# EAGLE design ssr (EAGLE 9.3.2)
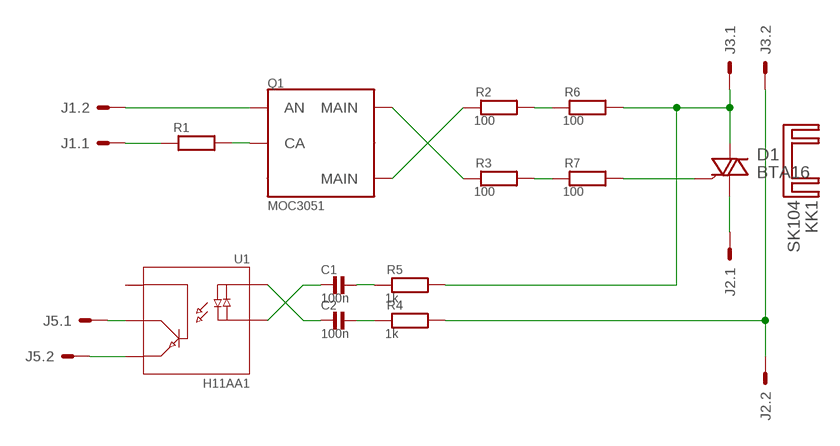
[diagram p0: schematic, sheet 1]

## Parts
C1  100n  MLCC_1206  [_1206]
C2  100n  MLCC_1206  [_1206]
D1  BTA16  [TO220DS]
J1  2EDG-2P  [2EDG-2P]
J2  2EDG-2P  [2EDG-2P]
J3  2EDG-2P  [2EDG-2P]
J5  2EDG-2P  [2EDG-2P]
KK1  SK104  [SK104]
Q1  MOC3051  [DIP-6-SMD]
R1  220  RESISTOR0603  [0603_WAVE]
R2  100  RESISTOR_1206  [_1206]
R3  100  RESISTOR_1206  [_1206]
R4  1k  RESISTOR_1206  [_1206]
R5  1k  RESISTOR_1206  [_1206]
R6  100  RESISTOR_1206  [_1206]
R7  100  RESISTOR_1206  [_1206]
U1  H11AA1  [DIP-6-SMD]

## Nets
GND: J1.P$1 R1.P$1
GND1: J5.P$2 U1.P$4(E)
N$2: Q1.P$2(CA) R1.P$2
N$3: J2.P$2 J3.P$2 R4.2
N$4: Q1.P$6(MAIN) R2.1
N$5: R3.2 R7.1
N$6: Q1.P$4(MAIN) R3.1
N$7: D1.A2 J3.P$1 R5.2 R6.2
N$8: D1.A1 J2.P$1
N$9: C1.1 R5.1
N$10: C1.2 U1.P$2(CA)
N$11: C2.2 U1.P$1(AC)
N$12: C2.1 R4.1
N$13: R2.2 R6.1
N$14: D1.G R7.2
N$15: J5.P$1 U1.P$5(C)
N$16: J1.P$2 Q1.P$1(AN)
Unconnected: U1.P$6(B)

## Library data of the parts
C1 C2 = Passive Components > Capacitors > Multilayer Ceramic Capacitors MLCC:MLCC: KEMET’s X7R dielectric features a 125°C maximum operating temperature and is considered temperature stable. The Electronics Components, Assemblies and Materials Association (EIA) characterizes X7R dielectric as a Class II material. Components of this classification are fixed, ceramic dielectric capacitors suited for bypass and decoupling applications or for frequency discriminating circuits where Q and stability of capacitance characteristics are not critical. X7R exhibits a predictable change in capacitance with respect to time and voltage, boasting a minimal change in capacitance with reference to ambient temperature. Capacitance change is limited to ±15% from −55°C to +125°C.
D1 = Semiconductors > Discrete Semiconductors > Thyristors > Triacs:BTA16
J1-J3 J5 = Connectors > Other:2EDG-2P
KK1 = Thermal Management > Heatsinks:SK104: HEATSINK manufacturer Fischer/distributor Buerklin
Q1 = Opto-electronics > Optocouplers\Photocouplers:MOC3051: The MOC3051-M and MOC3052-M consist of a AlGaAs infrared emitting diode optically coupled to a non-zero-crossing silicon bilateral AC switch (triac). These devices isolate low voltage logic from 115 and 240 Vac lines to provide random phase control of high current triacs or thyristors. These devices feature greatly enhanced static dv/dt capability to ensure stable switching performance of inductive loads.
R1-R7 = Passive Components > Resistors > Chip Resistors:RESISTOR: Resistors For new designs, use the packages preceded by an '_' character since they are more reliable: The following footprints should be used on most boards: _0402 - Standard footprint for regular board layouts _0603 - Standard footprint for regular board layouts _0805 - Standard footprint for regular board layouts _1206 - Standard footprint for regular board layouts For extremely tight-pitch boards where space is at a premium, the following 'micro-pitch' footprints can be used (smaller pads, no silkscreen outline, etc.): _0402MP - Micro-pitch footprint for very dense/compact boards _0603MP - Micro-pitch footprint for very dense/compact boards _0805MP - Micro-pitch footprint for very dense/compact boards _1206MP - Micro-pitch footprint for very dense/compact boards
U1 = Opto-electronics > Optocouplers\Photocouplers:H11AA1

## Board
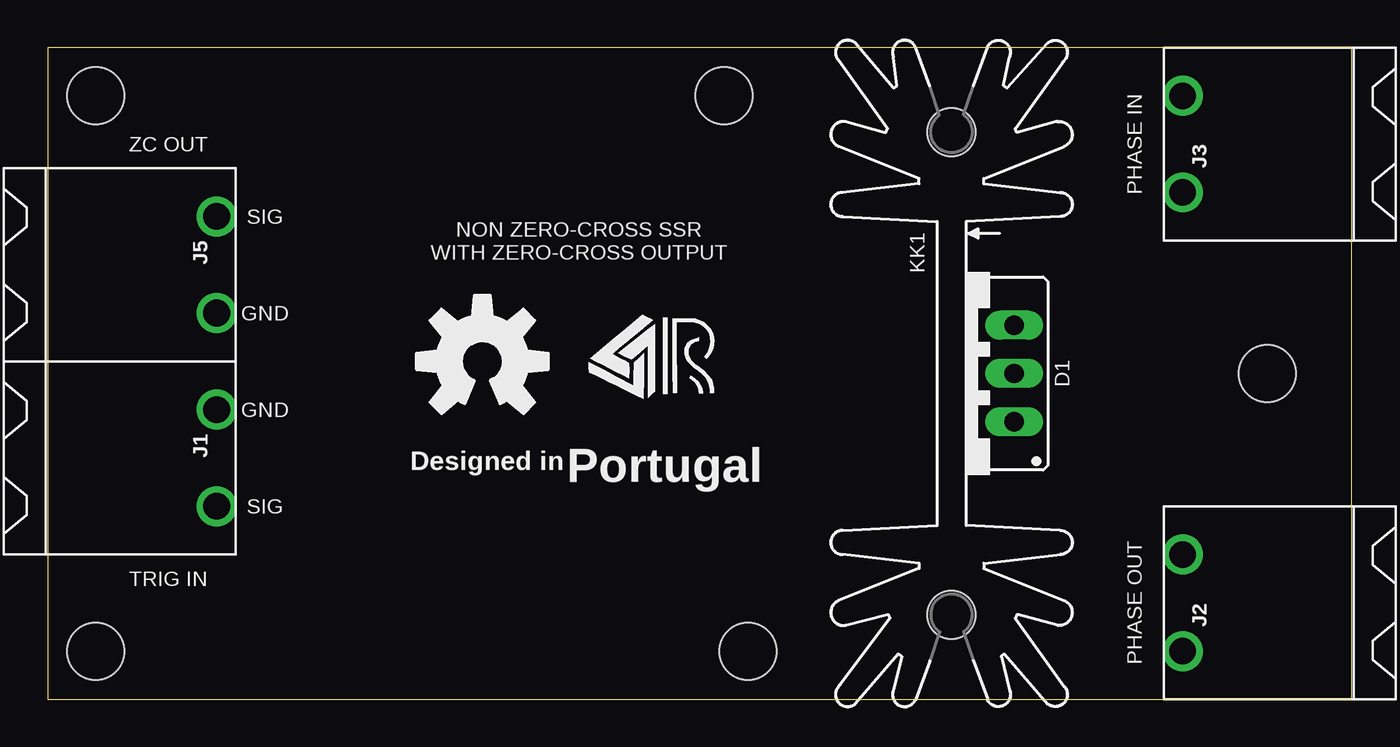
[diagram p1: board, top side]
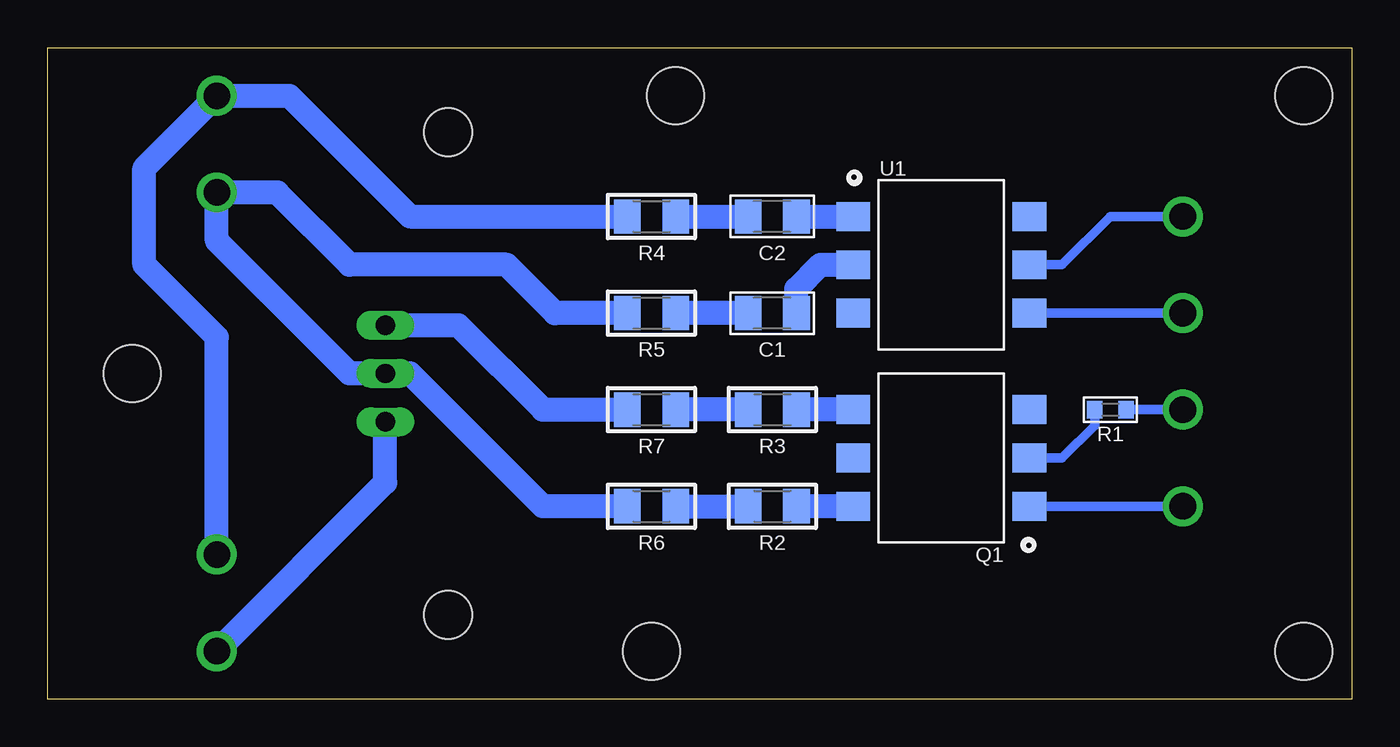
[diagram p2: board, bottom side, seen from below]

Size 68.59 x 34.29 mm. Coordinates in mm from the lower left corner, seen from the top.
Outline: 0.01,0 68.59,0 68.59,34.29 0,34.29 0.01,0
Copper layers (1*16): Top 0.035mm / dielectric 0.15mm / Bottom 0.035mm
Design rules "default": minimum track width 6mil, minimum drill 0.35mm, track to track 6mil, track to pad 6mil, pad to pad 6mil, via to via 6mil, smd to smd 6mil, copper to edge 40mil, drill to drill 6mil, minimum pad ring 10mil, minimum via ring 8mil, stop-mask expansion 4mil, vias tented up to drill 0mil, thermal gap 10mil
Holes 3 mm at 2.54,31.75 2.54,2.54 36.84,2.54 35.57,31.75 64.14,17.14

### Footprints (pad centres in the part's own frame; a part is rotated, then mirrored left to right if it is on the bottom)
_1206 = smd 1.4 x 1.8: 1 -1.27,0; 2 1.27,0
TO220DS = drill 1.016 long: A1 -2.54,-2.54; A2 0,-2.54; G 2.54,-2.54
2EDG-2P = drill 1.4: P$1 -2.54,0; P$2 2.54,0
SK104 = hole 2.54: -12.7,-0.762; 12.7,-0.762
DIP-6-SMD = smd 1.52 x 1.78: P$1 -2.54,-4.635; P$2 0,-4.635; P$3 2.54,-4.635; P$4 2.54,4.635; P$5 0,4.635; P$6 -2.54,4.635
0603_WAVE = smd 0.8 x 0.9: P$1 -0.823,0; P$2 0.823,0

### Placement (x,y rotation side)
C1  30.48,20.32 0 bottom
C2  30.48,25.4 0 bottom
D1  48.3,17.14 90 top
J1  8.9,12.7 270 top
J2  59.7,5.08 90 top
J3  59.7,29.21 90 top
J5  8.9,22.86 270 top
KK1  48.3,17.14 270 top
Q1  21.59,12.7 90 bottom
R1  12.71,15.24 180 bottom
R2  30.48,10.16 180 bottom
R3  30.48,15.24 180 bottom
R4  36.84,25.4 180 bottom
R5  36.84,20.32 180 bottom
R6  36.84,10.16 180 bottom
R7  36.84,15.24 180 bottom
U1  21.59,22.86 270 bottom
U$1  [DESIGNEDINPT]  26.68,11.43 0 top
U$2  [RAFAEL_SILVA_5MM_ALT_3]  29.21,17.78 0 top
U$3  [OSHW-LOGO-L]  22.86,17.78 0 top

### Tracks (layer width: path | path; a pad name or v marks a point on that pad's centre or on a via)
GND
  Bottom 0.508: R1.P$1 J1.P$1
GND1
  Bottom 0.508: J5.P$2 U1.P$4
N$2
  Bottom 0.508: Q1.P$2 15.25,12.7 13.53,14.42 R1.P$2
N$3
  Bottom 1.27: R4.2 49.54,25.4 55.89,31.75 J3.P$2 63.51,27.94 63.51,22.86 59.7,19.05 J2.P$2
N$4
  Bottom 1.27: Q1.P$6 R2.1
N$5
  Bottom 1.27: R3.2 R7.1
N$6
  Bottom 1.27: Q1.P$4 R3.1
N$7
  Bottom 1.27: R6.2 42.55,10.16 49.54,17.14 D1.A2 52.71,17.14 59.7,24.13 J3.P$1 56.52,26.67 52.71,22.86 44.46,22.86 41.91,20.32 R5.2
N$8
  Bottom 1.27: J2.P$1 50.84,11.4 D1.A1
N$9
  Bottom 1.27: C1.1 R5.1
N$10
  Bottom 1.27: C1.2 29.21,21.59 27.95,22.86 U1.P$2
N$11
  Bottom 1.27: C2.2 U1.P$1
N$12
  Bottom 1.27: R4.1 C2.1
N$13
  Bottom 1.27: R6.1 R2.2
N$14
  Bottom 1.27: D1.G 47,19.68 42.55,15.24 R7.2
N$15
  Bottom 0.508: U1.P$5 15.25,22.86 12.71,25.4 J5.P$1
N$16
  Bottom 0.508: J1.P$2 Q1.P$1

### Text on the board
tPlace: ZC OUT | PHASE IN | SIG | NON ZERO-CROSS SSR / WITH ZERO-CROSS OUTPUT | GND | GND | SIG | TRIG IN | PHASE OUT